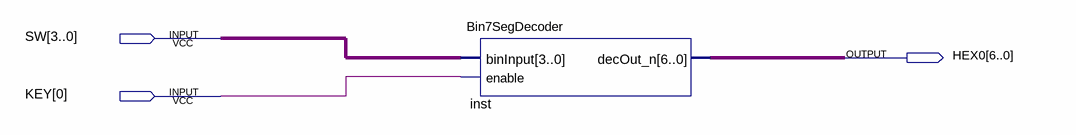
[diagram p0: schematic sheet]
// Quartus schematic DisplayDemo.bdf as structural Verilog: 1 symbols, 3 pins
module DisplayDemo (
  input  [3:0] SW,
  input  [0:0] KEY,
  output [6:0] HEX0
);

  Bin7SegDecoder inst (.binInput(SW), .enable(KEY[0]), .decOut_n(HEX0));
endmodule
